# Altium schematic sheet Safety_2019_V_3_0_Enable.SchDoc
size A
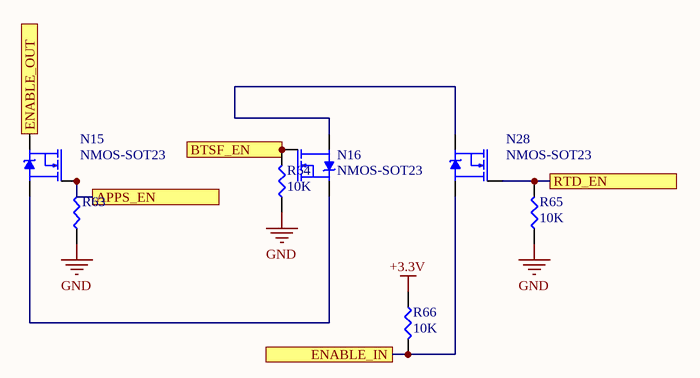
[diagram p0: Safety_2019_V_3_0_Enable.SchDoc]

## Parts
N15  NMOS-SOT23  [SOT23]
N16  NMOS-SOT23  [SOT23]
N28  NMOS-SOT23  [SOT23]
R63  (no value)  [RES-0603]
R64  10K  [RES-0603]
R65  10K  [RES-0603]
R66  10K  [RES-0603]

## Ports
APPS_EN, BTSF_EN, ENABLE_IN, ENABLE_OUT, RTD_EN

## Nets
+3.3V: R66.1
GND: R63.1 R64.1 R65.1
APPS_EN: N15.1(G) R63.2 ; port APPS_EN
BTSF_EN: N16.1(G) R64.2 ; port BTSF_EN
ENABLE_IN: N28.2(S) R66.2 ; port ENABLE_IN
ENABLE_OUT: N15.3(D) ; port ENABLE_OUT
RTD_EN: N28.1(G) R65.2 ; port RTD_EN
NetN15_2: N15.2(S) N16.3(D)
NetN16_2: N16.2(S) N28.3(D)

## Library data of the parts
R63-R66 = RES-0603